# EAGLE design grissom (EAGLE 9.3.0)
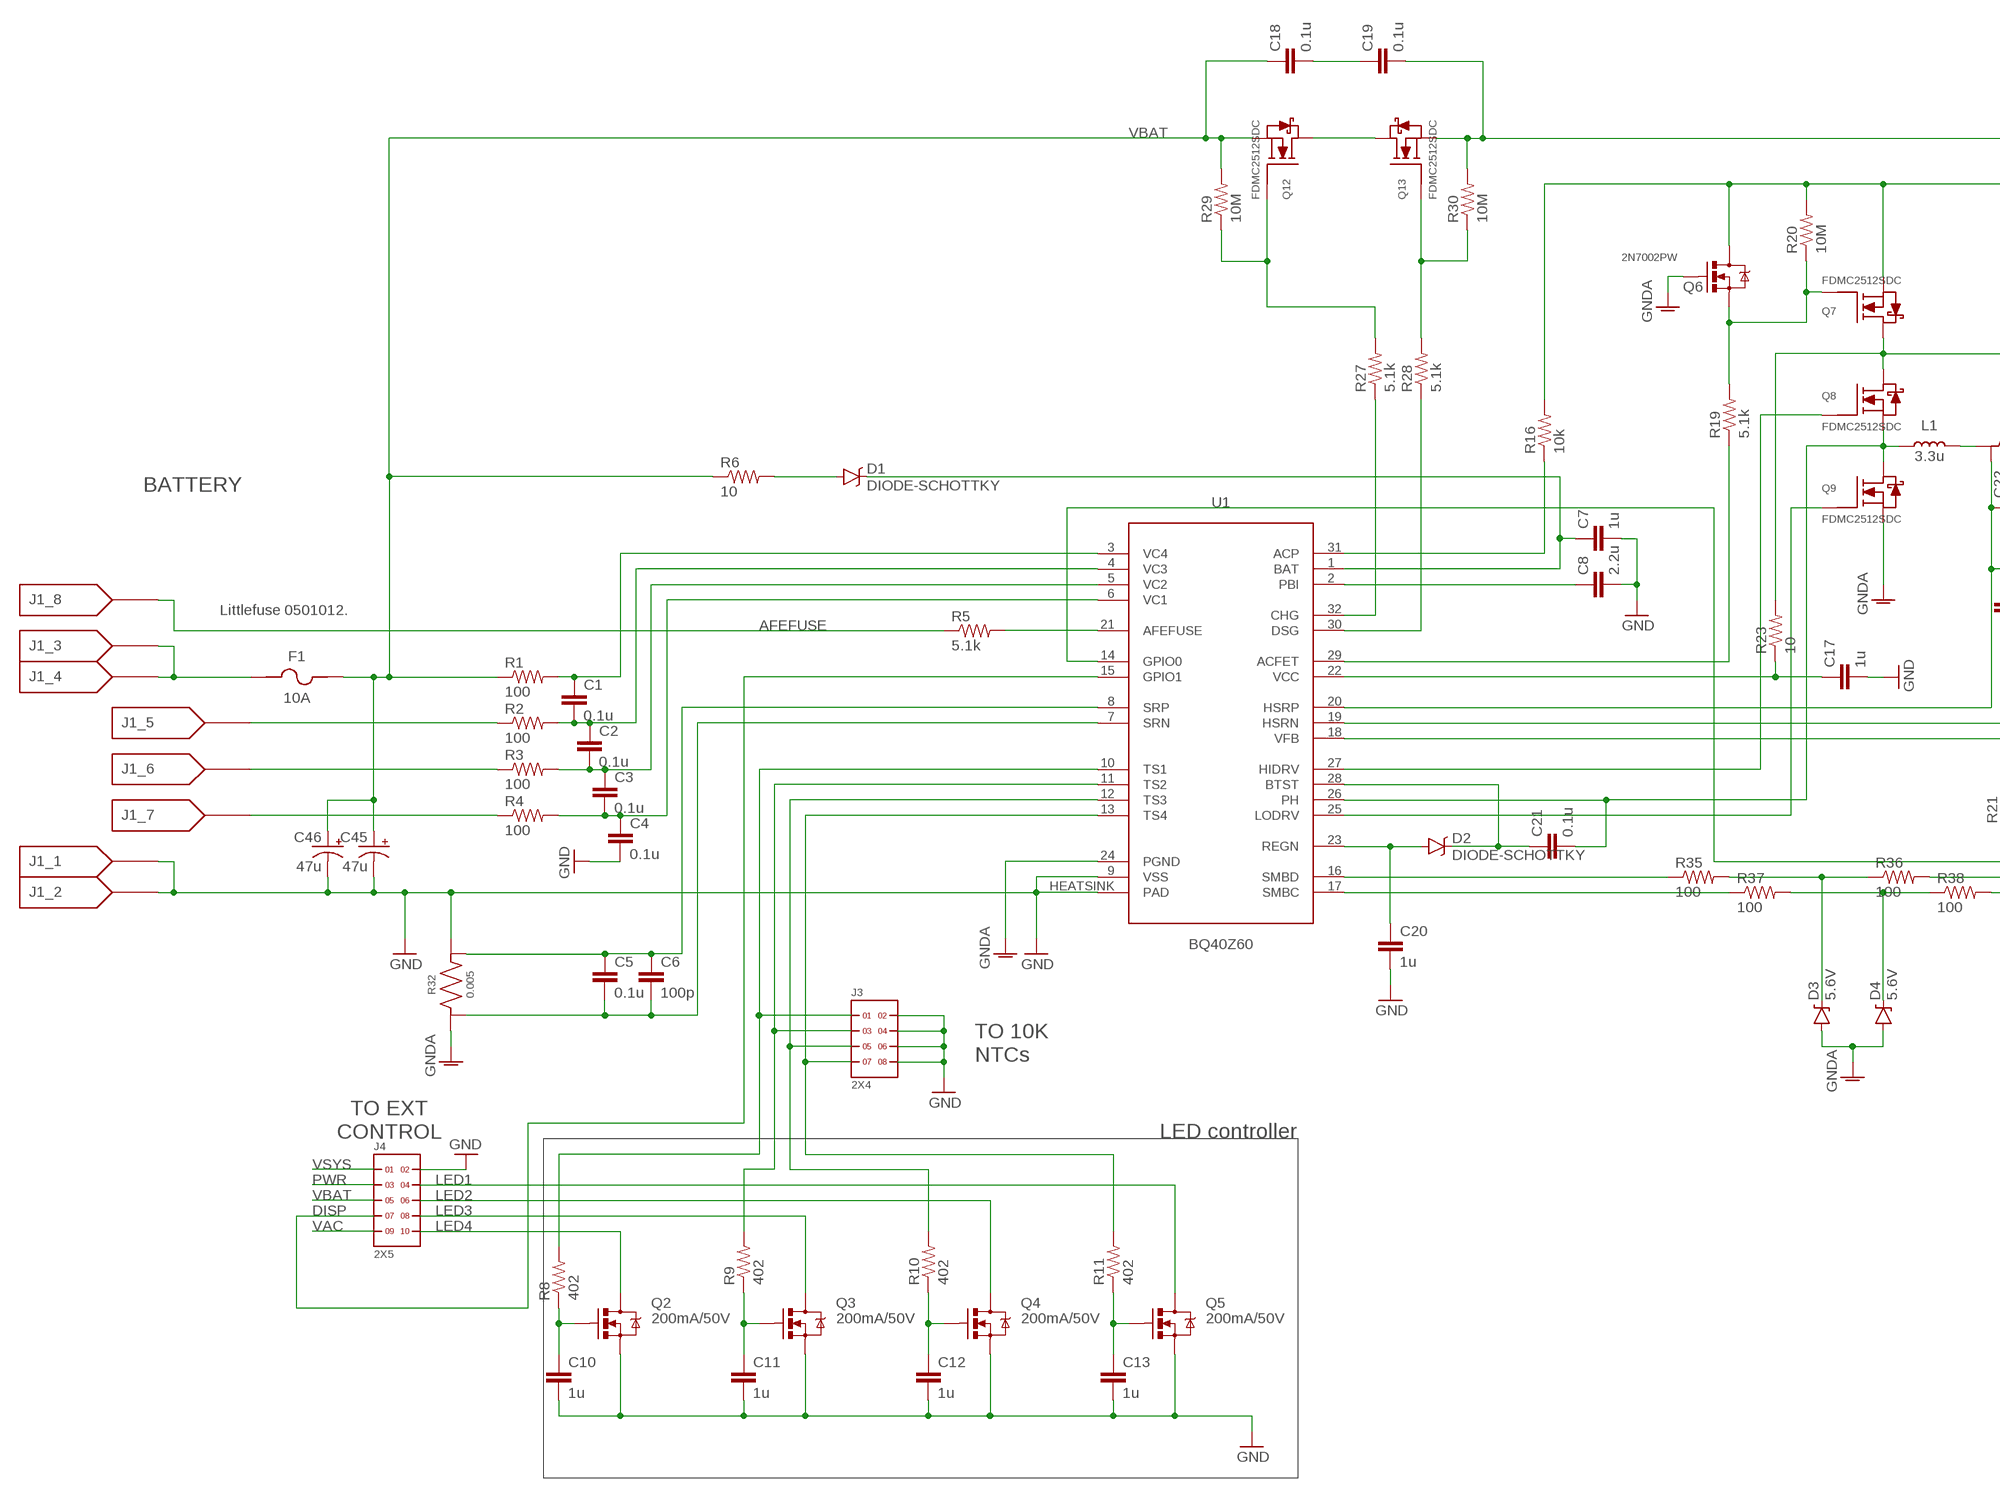
[diagram p0: schematic, sheet 1, part 1 of 2]
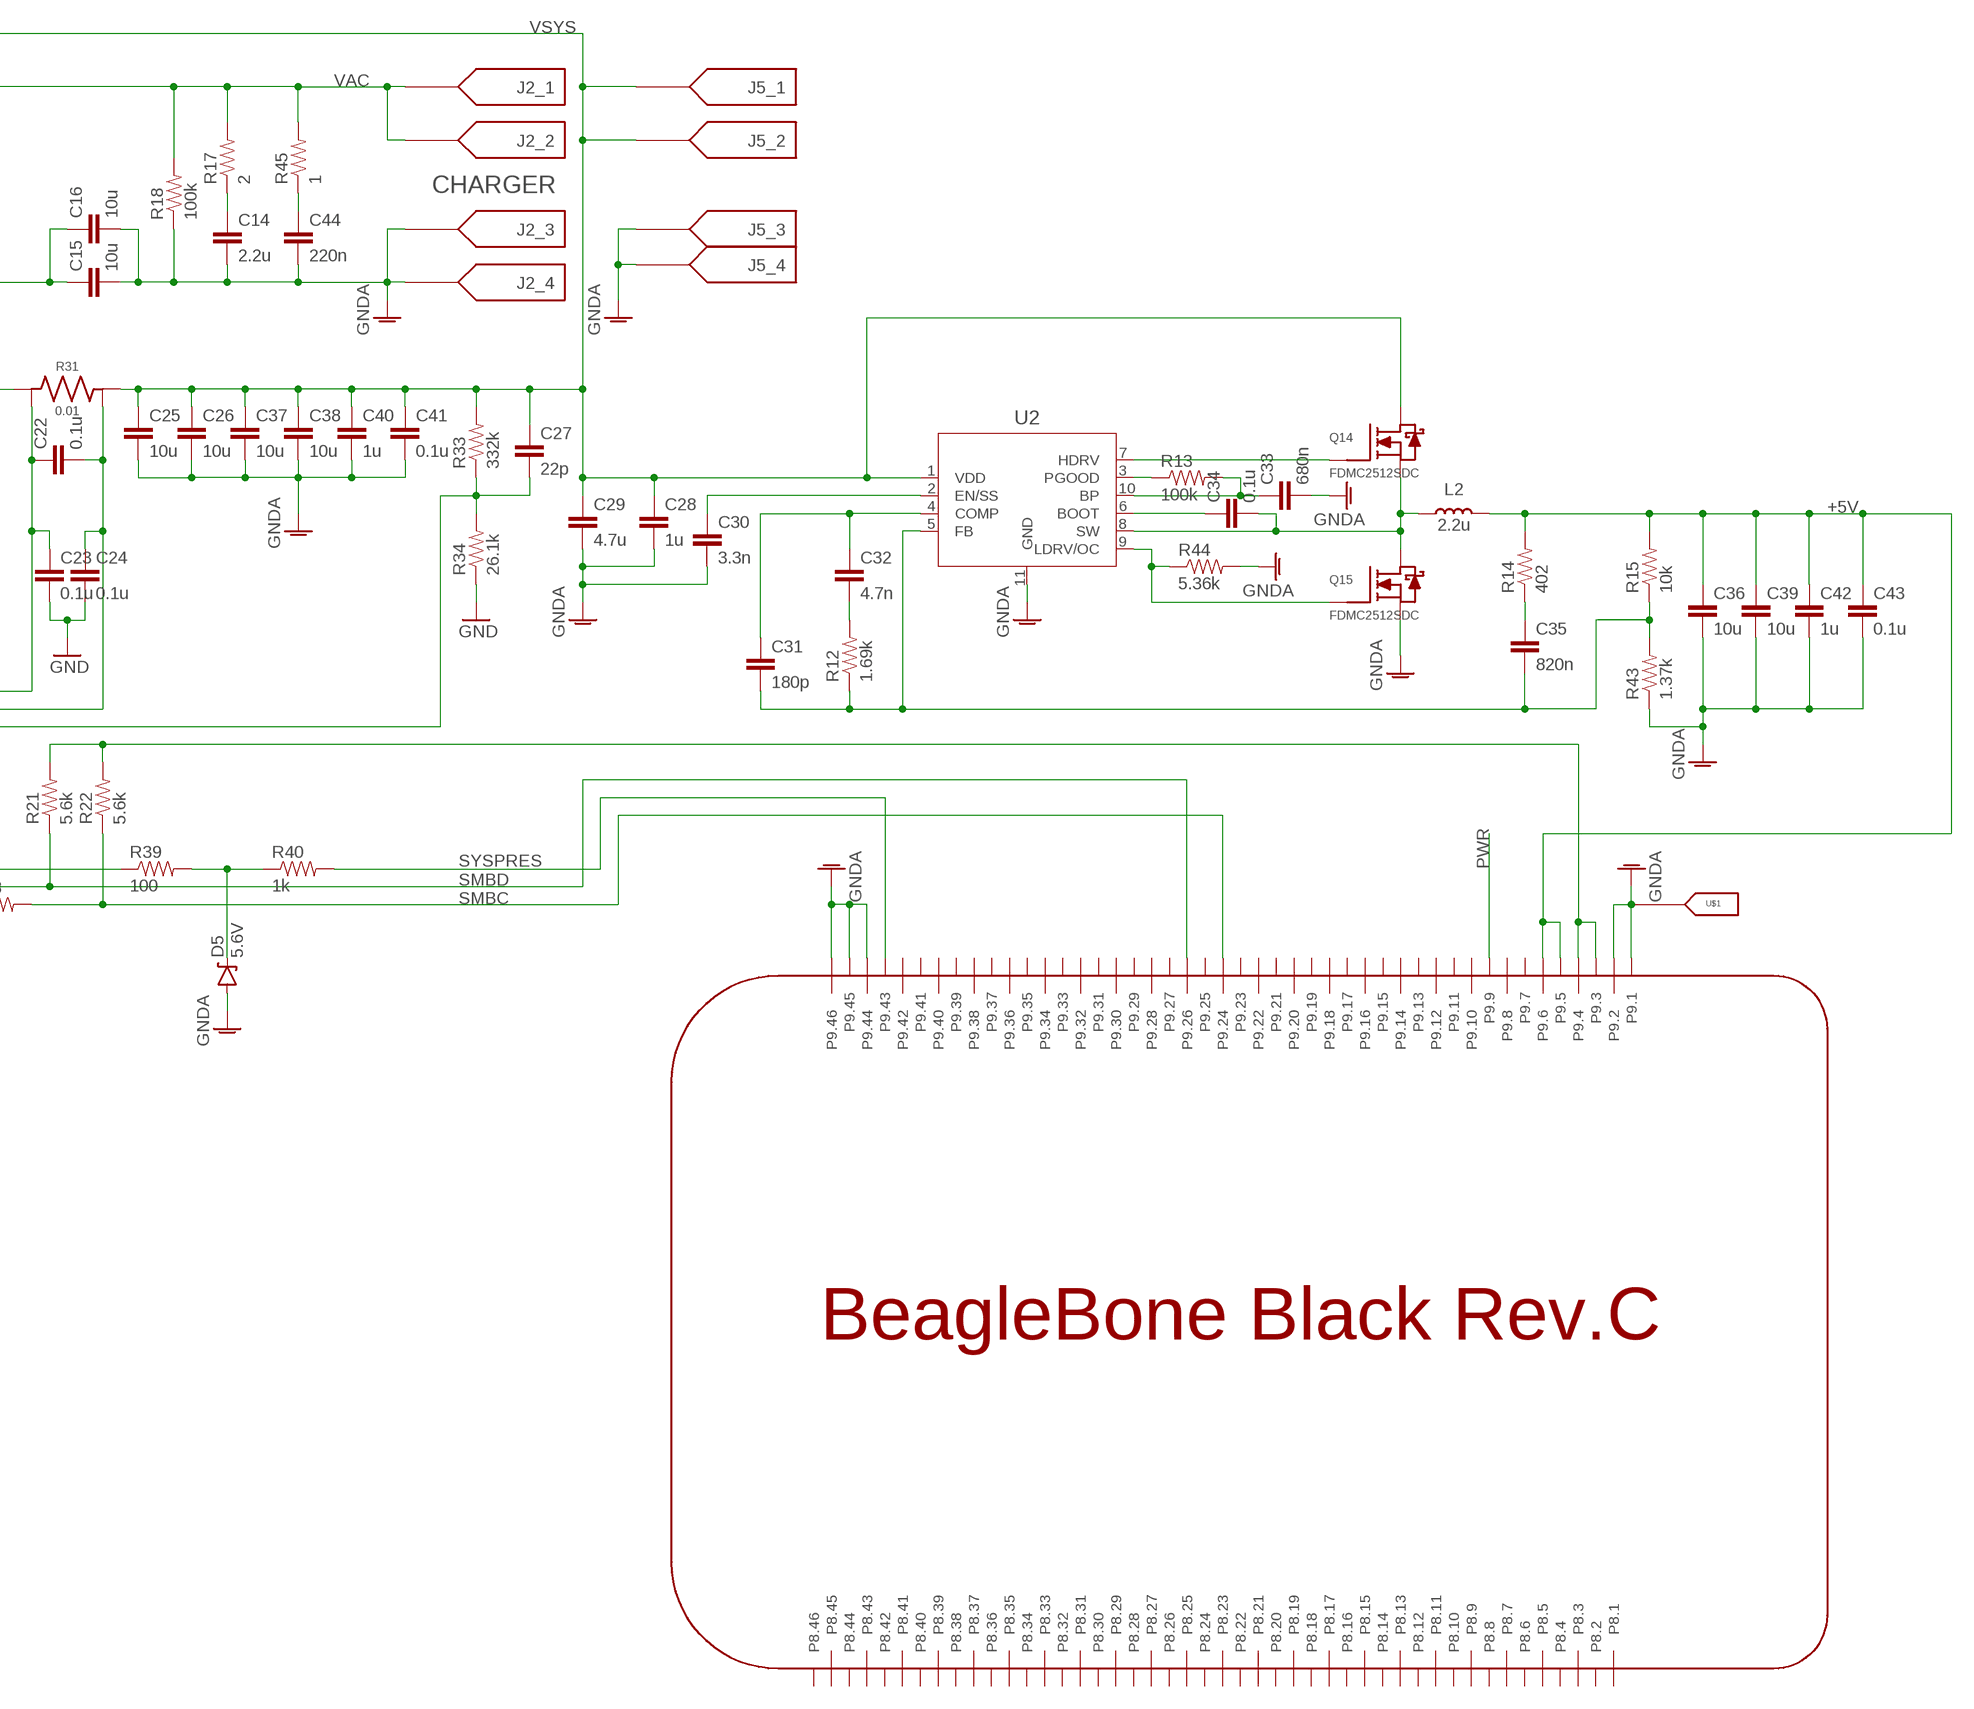
[diagram p1: schematic, sheet 1, part 2 of 2]

## Parts
C1  0.1u  CAP0805  [0805]
C2  0.1u  CAP0805  [0805]
C3  0.1u  CAP0805  [0805]
C4  0.1u  CAP0805  [0805]
C5  0.1u  CAP0805  [0805]
C6  100p  CAP0805  [0805]
C7  1u  CAP0805  [0805]
C8  2.2u  CAP0805  [0805]
C10  1u  CAP0805  [0805]
C11  1u  CAP0805  [0805]
C12  1u  CAP0805  [0805]
C13  1u  CAP0805  [0805]
C14  2.2u  CAP0805  [0805]
C15  10u  CAP1206  [1206]
C16  10u  CAP1206  [1206]
C17  1u  CAP0805  [0805]
C18  0.1u  CAP0805  [0805]
C19  0.1u  CAP0805  [0805]
C20  1u  CAP0805  [0805]
C21  0.1u  CAP0805  [0805]
C22  0.1u  CAP0805  [0805]
C23  0.1u  CAP0805  [0805]
C24  0.1u  CAP0805  [0805]
C25  10u  CAP1206  [1206]
C26  10u  CAP1206  [1206]
C27  22p  CAP0805  [0805]
C28  1u  CAP0805  [0805]
C29  4.7u  CAP0805  [0805]
C30  3.3n  CAP0805  [0805]
C31  180p  CAP0805  [0805]
C32  4.7n  CAP0805  [0805]
C33  680n  CAP0805  [0805]
C34  0.1u  CAP0805  [0805]
C35  820n  CAP0805  [0805]
C36  10u  CAP1206  [1206]
C37  10u  CAP1206  [1206]
C38  10u  CAP1206  [1206]
C39  10u  CAP1206  [1206]
C40  1u  CAP1206  [1206]
C41  0.1u  CAP1206  [1206]
C42  1u  CAP1206  [1206]
C43  0.1u  CAP1206  [1206]
C44  220n  CAP0805  [0805]
C45  47u  CAP_POLPTH2  [CPOL-RADIAL-10UF-25V]
C46  47u  CAP_POLPTH2  [CPOL-RADIAL-10UF-25V]
D1  DIODE-SCHOTTKY  [SOT23-3]
D2  DIODE-SCHOTTKY  [SOT23-3]
D3  5.6V  DIODE-ZENER5.6V  [SOD-323]
D4  5.6V  DIODE-ZENER5.6V  [SOD-323]
D5  5.6V  DIODE-ZENER5.6V  [SOD-323]
F1  10A  LITTELFUSE_501  [LITTELFUSE_501]
J1  105314-X208  [105314-X208]
J2  105314-X204  [105314-X204]
J3  2X4  [2X4]
J4  2X5  [2X5]
J5  105314-X204  [105314-X204]
L1  3.3u  BOURNS_SRP7028A  [BOURNS_SRP7028A]
L2  2.2u  BOURNS_SRP7028A  [BOURNS_SRP7028A]
PCB1  BEAGLEBONE_BLACK_BLANK  [BEAGLEBONE_BLACK_BLANK]
Q2  200mA/50V  MOSFET-NCHANNELBSS138  [SOT23-3]
Q3  200mA/50V  MOSFET-NCHANNELBSS138  [SOT23-3]
Q4  200mA/50V  MOSFET-NCHANNELBSS138  [SOT23-3]
Q5  200mA/50V  MOSFET-NCHANNELBSS138  [SOT23-3]
Q6  2N7002PW  MOSFET-NCHANNEL2N7002PW  [SOT323]
Q7  FDMC2512SDC  [MO240]
Q8  FDMC2512SDC  [MO240]
Q9  FDMC2512SDC  [MO240]
Q12  FDMC2512SDC  [MO240]
Q13  FDMC2512SDC  [MO240]
Q14  FDMC2512SDC  [MO240]
Q15  FDMC2512SDC  [MO240]
R1  100  RESISTOR0805-RES  [0805]
R2  100  RESISTOR0805-RES  [0805]
R3  100  RESISTOR0805-RES  [0805]
R4  100  RESISTOR0805-RES  [0805]
R5  5.1k  RESISTOR0805-RES  [0805]
R6  10  RESISTOR1206  [1206]
R8  402  RESISTOR0805-RES  [0805]
R9  402  RESISTOR0805-RES  [0805]
R10  402  RESISTOR0805-RES  [0805]
R11  402  RESISTOR0805-RES  [0805]
R12  1.69k  RESISTOR0805-RES  [0805]
R13  100k  RESISTOR0805-RES  [0805]
R14  402  RESISTOR0805-RES  [0805]
R15  10k  RESISTOR0805-RES  [0805]
R16  10k  RESISTOR0805-RES  [0805]
R17  2  RESISTOR0805-RES  [0805]
R18  100k  RESISTOR0805-RES  [0805]
R19  5.1k  RESISTOR0805-RES  [0805]
R20  10M  RESISTOR0805-RES  [0805]
R21  5.6k  RESISTOR0805-RES  [0805]
R22  5.6k  RESISTOR0805-RES  [0805]
R23  10  RESISTOR0805-RES  [0805]
R27  5.1k  RESISTOR0805-RES  [0805]
R28  5.1k  RESISTOR0805-RES  [0805]
R29  10M  RESISTOR0805-RES  [0805]
R30  10M  RESISTOR0805-RES  [0805]
R31  0.01  OHMITE_FC4L32  [1206_4T]
R32  0.005  VISHAY_WSK0612  [0612_4T]
R33  332k  RESISTOR0805-RES  [0805]
R34  26.1k  RESISTOR0805-RES  [0805]
R35  100  RESISTOR0805-RES  [0805]
R36  100  RESISTOR0805-RES  [0805]
R37  100  RESISTOR0805-RES  [0805]
R38  100  RESISTOR0805-RES  [0805]
R39  100  RESISTOR0805-RES  [0805]
R40  1k  RESISTOR0805-RES  [0805]
R43  1.37k  RESISTOR0805-RES  [0805]
R44  5.36k  RESISTOR0805-RES  [0805]
R45  1  RESISTOR0805-RES  [0805]
U1  BQ40Z60  [QFN32]
U2  TPS40305DRCR  [S-PVSON-N10]
U$1  SU_LOGO-DUMMY2  [SU_LOGO_SS]

## Nets
+5V: C36.1 C39.1 C42.1 C43.1 L2.P$2 PCB1.P9.5 PCB1.P9.6 R14.2 R15.2
AFEFUSE: J1.P$8 R5.1
DISP: J4.7 U1.15(GPIO1)
GND: C4.2 C7.2 C8.2 C10.2 C11.2 C12.2 C13.2 C17.2 C20.2 C23.2 C24.2 C45.2(-) C46.2(-) J1.P$1 J1.P$2 J3.2 J3.4 J3.6 J3.8 J4.2 Q2.2(S) Q3.2(S) Q4.2(S) Q5.2(S) R32.P$2 R34.1 U1.9(VSS) U1.HEATSINK(PAD)
GNDA: C14.2 C15.2 C16.2 C25.2 C26.2 C28.2 C29.2 C30.2 C33.2 C36.2 C37.2 C38.2 C39.2 C40.2 C41.2 C42.2 C43.2 C44.2 D3.A D4.A D5.A J2.P$3 J2.P$4 J5.P$3 J5.P$4 PCB1.P9.1 PCB1.P9.2 PCB1.P9.44 PCB1.P9.45 PCB1.P9.46 Q6.1(G) Q9.P$1(S) Q9.P$2(S) Q9.P$3(S) Q15.P$1(S) Q15.P$2(S) Q15.P$3(S) R18.1 R32.P$1 R43.1 R44.2 U1.24(PGND) U2.11(GND) U$1.P$1
LED1: J4.4 Q5.3(D)
LED2: J4.6 Q4.3(D)
LED3: J4.8 Q3.3(D)
LED4: J4.10 Q2.3(D)
N$1: R5.2 U1.21(AFEFUSE)
N$2: J1.P$5 R2.1
N$3: J1.P$6 R3.1
N$4: J1.P$7 R4.1
N$5: F1.P$1 J1.P$3 J1.P$4
N$6: C3.2 C4.1 R4.2 U1.6(VC1)
N$7: C1.1 R1.2 U1.3(VC4)
N$8: C1.2 C2.1 R2.2 U1.4(VC3)
N$9: C2.2 C3.1 R3.2 U1.5(VC2)
N$10: C5.1 C6.1 R32.P$4 U1.8(SRP)
N$11: C5.2 C6.2 R32.P$3 U1.7(SRN)
N$13: D1.1(A) D1.2(A) R6.2
N$14: C7.1 D1.3(C) U1.1(BAT)
N$15: C8.1 U1.2(PBI)
N$16: PCB1.P9.3 PCB1.P9.4 R21.2 R22.2
N$18: C17.1 R23.1 U1.22(VCC)
N$20: J3.1 R8.2 U1.10(TS1)
N$21: J3.3 R9.2 U1.11(TS2)
N$22: J3.5 R10.2 U1.12(TS3)
N$23: J3.7 R11.2 U1.13(TS4)
N$24: C10.1 Q2.1(G) R8.1
N$26: C11.1 Q3.1(G) R9.1
N$28: C12.1 Q4.1(G) R10.1
N$30: C13.1 Q5.1(G) R11.1
N$32: C32.2 R12.2
N$33: C30.1 U2.2(EN/SS)
N$34: C31.1 C32.1 U2.4(COMP)
N$35: C31.2 C35.2 R12.1 R15.1 R43.2 U2.5(FB)
N$36: C14.1 R17.1
N$37: R16.1 U1.31(ACP)
N$38: C34.2 L2.P$1 Q14.P$1(S) Q14.P$2(S) Q14.P$3(S) Q15.P$5(D) Q15.P$6(D) Q15.P$7(D) Q15.P$8(D) Q15.PAD(D) U2.8(SW)
N$39: C15.1 C16.1 Q7.P$5(D) Q7.P$6(D) Q7.P$7(D) Q7.P$8(D) Q7.PAD(D) Q8.P$5(D) Q8.P$6(D) Q8.P$7(D) Q8.P$8(D) Q8.PAD(D) R23.2
N$40: Q6.2(S) Q7.P$4(G) R19.2 R20.1
N$41: R19.1 U1.29(ACFET)
N$42: Q14.P$4(G) U2.7(HDRV)
N$43: Q8.P$4(G) U1.27(HIDRV)
N$45: Q9.P$4(G) U1.25(LODRV)
N$47: Q15.P$4(G) R44.1 U2.9(LDRV/OC)
N$48: R28.1 U1.30(DSG)
N$49: R27.1 U1.32(CHG)
N$50: Q13.P$4(G) R28.2 R30.1
N$51: Q12.P$4(G) R27.2 R29.1
N$52: Q12.P$5(D) Q12.P$6(D) Q12.P$7(D) Q12.P$8(D) Q12.PAD(D) Q13.P$5(D) Q13.P$6(D) Q13.P$7(D) Q13.P$8(D) Q13.PAD(D)
N$53: R13.1 U2.3(PGOOD)
N$54: C21.1 D2.3(C) U1.28(BTST)
N$55: C18.2 C19.1
N$56: C21.2 L1.P$1 Q8.P$1(S) Q8.P$2(S) Q8.P$3(S) Q9.P$5(D) Q9.P$6(D) Q9.P$7(D) Q9.P$8(D) Q9.PAD(D) U1.26(PH)
N$57: C20.1 D2.1(A) D2.2(A) U1.23(REGN)
N$58: L1.P$2 R31.P$1
N$59: C22.1 C23.1 R31.P$3 U1.20(HSRP)
N$60: C22.2 C24.1 R31.P$4 U1.19(HSRN)
N$62: C27.2 R33.1 R34.2 U1.18(VFB)
N$64: R35.1 U1.16(SMBD)
N$65: D3.C R35.2 R36.1
N$66: PCB1.P9.26 R21.1 R36.2
N$67: R37.1 U1.17(SMBC)
N$68: D4.C R37.2 R38.1
N$69: PCB1.P9.24 R22.1 R38.2
N$70: C33.1 R13.2 U2.10(BP)
N$71: R39.1 U1.14(GPIO0)
N$72: D5.C R39.2 R40.1
N$73: PCB1.P9.43 R40.2
N$74: C34.1 U2.6(BOOT)
N$76: C35.1 R14.1
N$77: C44.1 R45.1
PWR: J4.3 PCB1.P9.9
VAC: J2.P$1 J2.P$2 J4.9 Q6.3(D) Q7.P$1(S) Q7.P$2(S) Q7.P$3(S) R16.2 R17.2 R18.2 R20.2 R45.2
VBAT: C18.1 C45.1(+) C46.1(+) F1.P$2 J4.5 Q12.P$1(S) Q12.P$2(S) Q12.P$3(S) R1.1 R6.1 R29.2
VSYS: C19.2 C25.1 C26.1 C27.1 C28.1 C29.1 C37.1 C38.1 C40.1 C41.1 J4.1 J5.P$1 J5.P$2 Q13.P$1(S) Q13.P$2(S) Q13.P$3(S) Q14.P$5(D) Q14.P$6(D) Q14.P$7(D) Q14.P$8(D) Q14.PAD(D) R30.2 R31.P$2 R33.2 U2.1(VDD)
Unconnected: PCB1.P8.1 PCB1.P8.2 PCB1.P8.3 PCB1.P8.4 PCB1.P8.5 PCB1.P8.6 PCB1.P8.7 PCB1.P8.8 PCB1.P8.9 PCB1.P8.10 PCB1.P8.11 PCB1.P8.12 PCB1.P8.13 PCB1.P8.14 PCB1.P8.15 PCB1.P8.16 PCB1.P8.17 PCB1.P8.18 PCB1.P8.19 PCB1.P8.20 PCB1.P8.21 PCB1.P8.22 PCB1.P8.23 PCB1.P8.24 PCB1.P8.25 PCB1.P8.26 PCB1.P8.27 PCB1.P8.28 PCB1.P8.29 PCB1.P8.30 PCB1.P8.31 PCB1.P8.32 PCB1.P8.33 PCB1.P8.34 PCB1.P8.35 PCB1.P8.36 PCB1.P8.37 PCB1.P8.38 PCB1.P8.39 PCB1.P8.40 PCB1.P8.41 PCB1.P8.42 PCB1.P8.43 PCB1.P8.44 PCB1.P8.45 PCB1.P8.46 PCB1.P9.7 PCB1.P9.8 PCB1.P9.10 PCB1.P9.11 PCB1.P9.12 PCB1.P9.13 PCB1.P9.14 PCB1.P9.15 PCB1.P9.16 PCB1.P9.17 PCB1.P9.18 PCB1.P9.19 PCB1.P9.20 PCB1.P9.21 PCB1.P9.22 PCB1.P9.23 PCB1.P9.25 PCB1.P9.27 PCB1.P9.28 PCB1.P9.29 PCB1.P9.30 PCB1.P9.31 PCB1.P9.32 PCB1.P9.33 PCB1.P9.34 PCB1.P9.35 PCB1.P9.36 PCB1.P9.37 PCB1.P9.38 PCB1.P9.39 PCB1.P9.40 PCB1.P9.41 PCB1.P9.42

## Notes on the sheet
- CHARGER
- BATTERY
- Littlefuse 0501012.
- SYSPRES
  SMBD
  SMBC
- TO 10K
  NTCs
- TO EXT
  CONTROL
- LED controller

## Library data of the parts
C1-C8 C10-C44 = SparkFun-Capacitors:CAP: Capacitor Standard 0603 ceramic capacitor, and 0.1" leaded capacitor.
C45 C46 = SparkFun-Capacitors:CAP_POL: Capacitor Polarized These are standard SMD and PTH capacitors. Normally 10uF, 47uF, and 100uF in electrolytic and tantalum varieties. Always verify the external diameter of the through hole cap, it varies with capacity, voltage, and manufacturer. The EIA devices should be standard.
D1 D2 = SparkFun-DiscreteSemi:DIODE-SCHOTTKY: Schottky diodes in SFE's production catalog BAT20J 1A 23V 0.62Vf RB751 120mA 40V 0.37Vf PMEG4005EJ 0.5A 40V 0.42Vf MBRA140 1A 40V 0.5Vf B340A 3A 40V SMA
D3-D5 = SparkFun-DiscreteSemi:DIODE-ZENER: Zener Diode Production Part - 8199 3.4V Zener Voltage; PROD_ID: DIO-12442
F1 = components:LITTELFUSE_501
J1 = molex_nanofit:105314-X208
J2 J5 = molex_nanofit:105314-X204
J3 = headers(2mm):2X4
J4 = headers(2mm):2X5
L1 L2 = components:BOURNS_SRP7028A
PCB1 = e14_BeagleBoneBlack_RevB:BEAGLEBONE_BLACK_BLANK
Q2-Q5 = SparkFun-DiscreteSemi:MOSFET-NCHANNEL: Common NMOSFET Parts MFG P/N Store ID Prod ID FDD8780 TRANS-09984 SI7820DN TRANS-11055 FDS6630A IC-08089 2N7002PW TRANS-11151 FQP30N06L COM-10213 TRANS-10060 BSS123LT1G TRANS-08345 BSS138 TRANS-00830 BS170 2N7000; PROD_ID: TRANS-00830
Q6 = SparkFun-DiscreteSemi:MOSFET-NCHANNEL: Common NMOSFET Parts MFG P/N Store ID Prod ID FDD8780 TRANS-09984 SI7820DN TRANS-11055 FDS6630A IC-08089 2N7002PW TRANS-11151 FQP30N06L COM-10213 TRANS-10060 BSS123LT1G TRANS-08345 BSS138 TRANS-00830 BS170 2N7000; PROD_ID: TRANS-11151
Q7-Q9 Q12-Q15 = components:FDMC2512SDC
R1-R6 R8-R23 R27-R30 R33-R40 R43-R45 = SparkFun-Resistors:RESISTOR: Resistor Basic schematic elements and footprints for 0603, 1206, and PTH resistors.
R31 = components:OHMITE_FC4L32
R32 = components:VISHAY_WSK0612
U1 = components:BQ40Z60
U2 = TPS40305:TPS40305DRCR; DATASHEETURL: http://www.ti.com/product/tps40305; FREQUENCY: 1200000.0; IMAX: 25.0; MANUFACTURER_NAME: Texas Instruments; MANUFACTURER_PART_NUMBER: TPS40305DRCR; MKTG_PACKAGE: TPS40305; NSID: TPS40305DRCT; PACKAGE: TPS40305; VENDOR: Texas Instruments
U$1 = components:SU_LOGO-DUMMY2

## Board
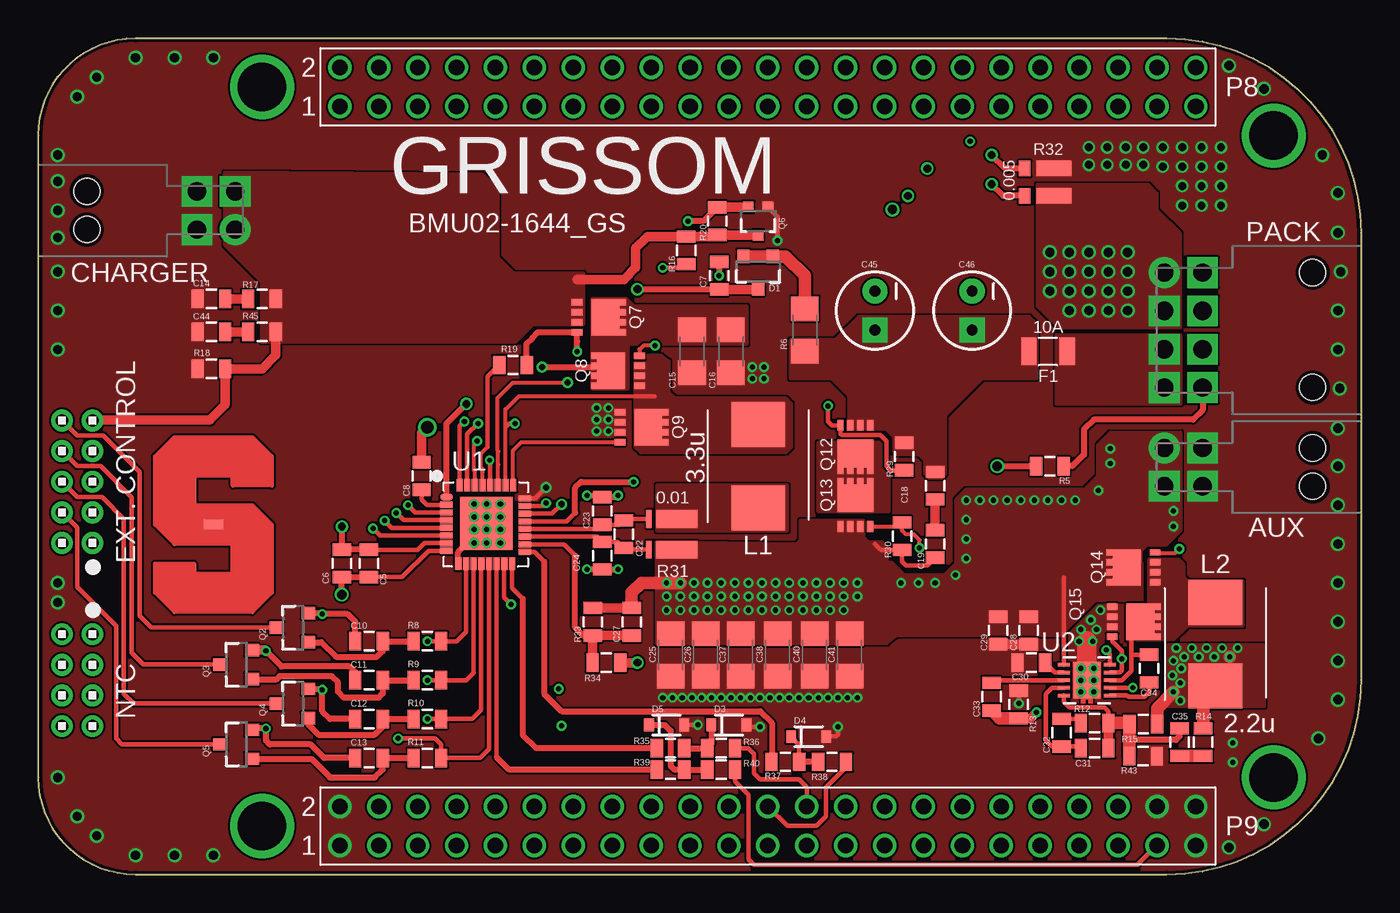
[diagram p2: board, top side]
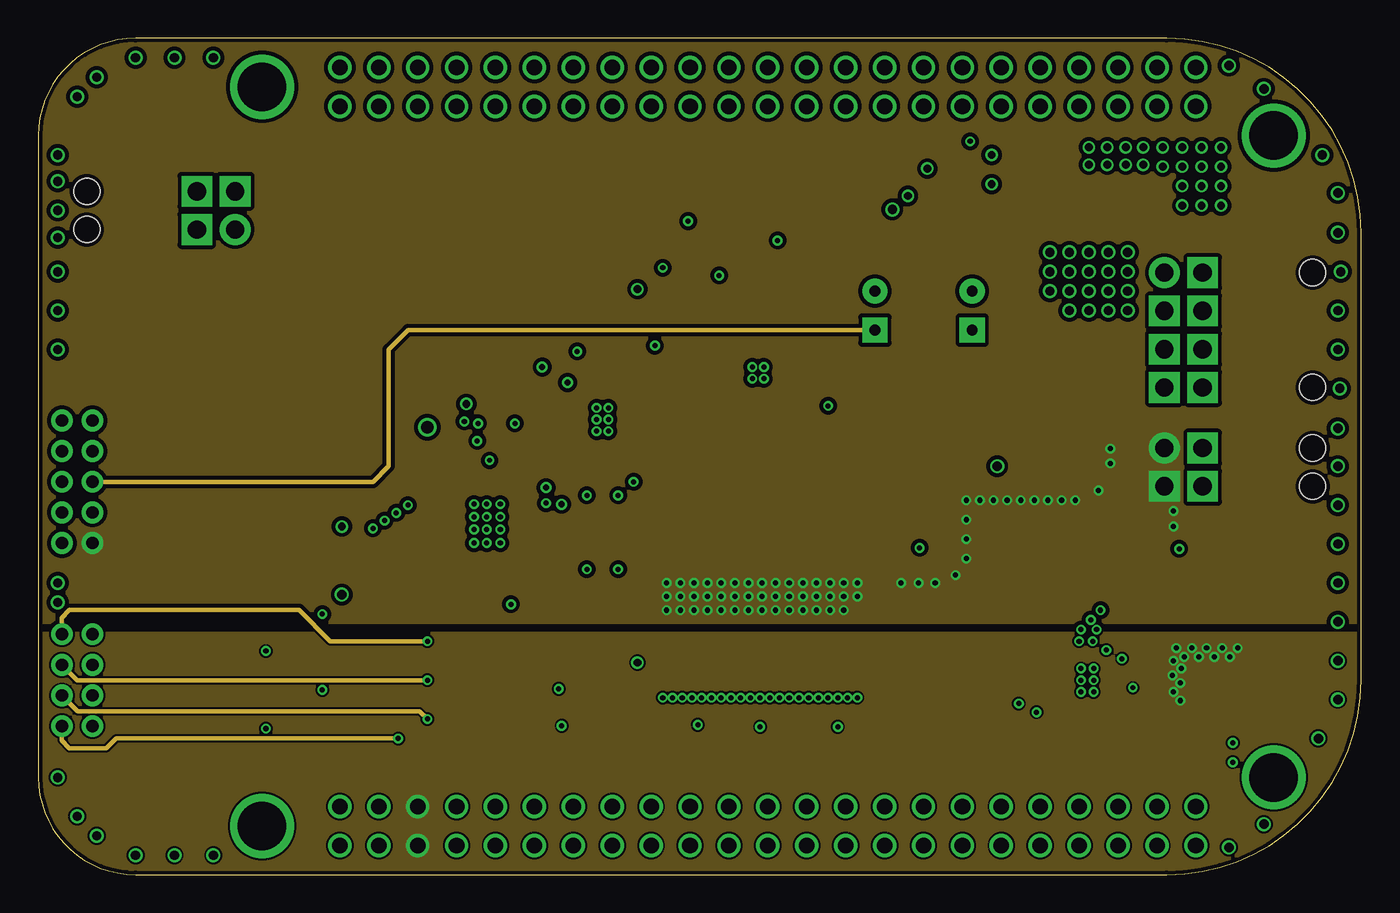
[diagram p3: board, inner layer Route2]
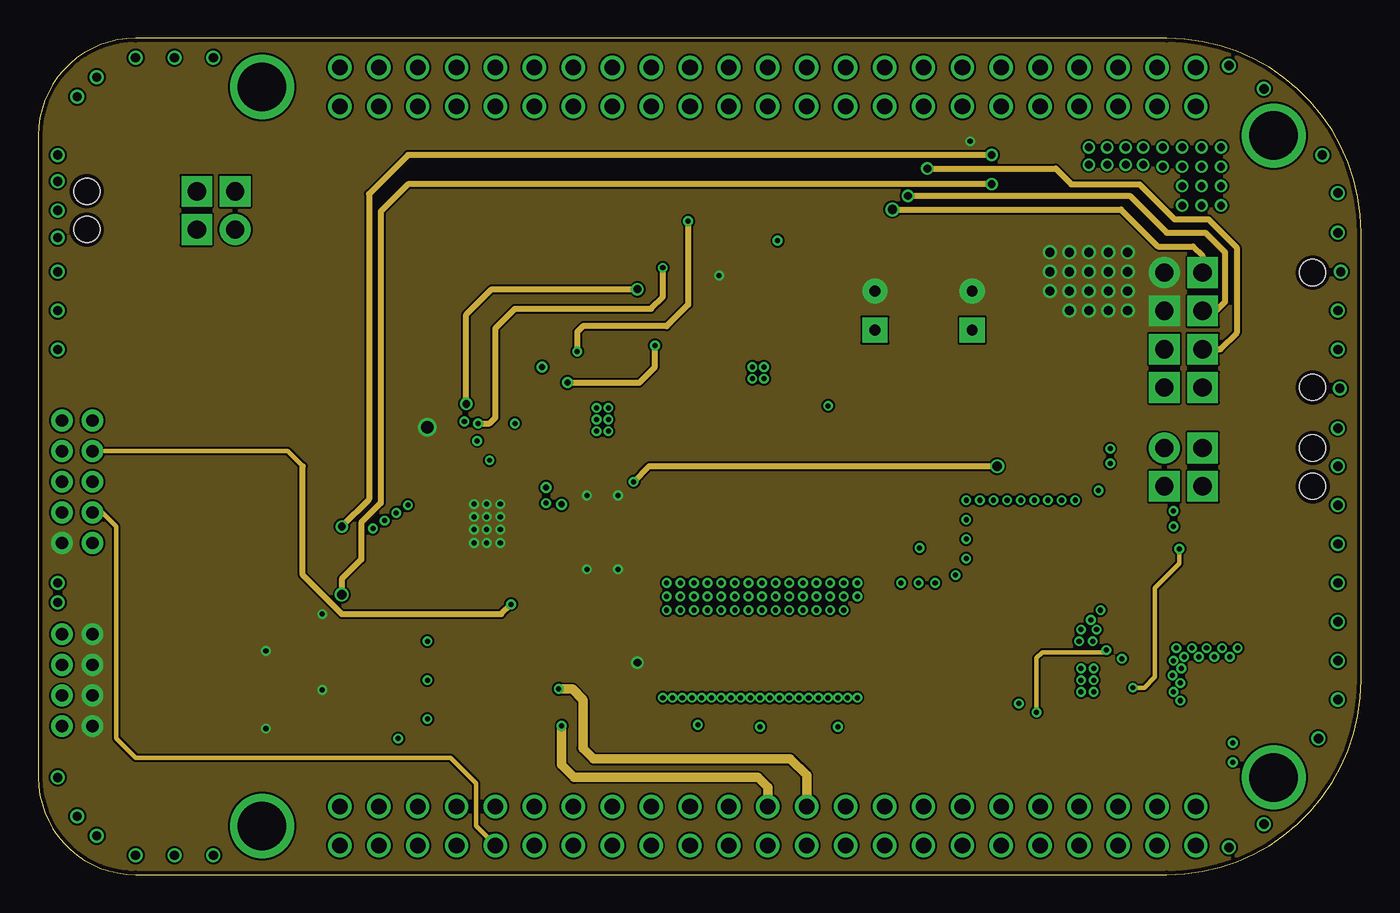
[diagram p4: board, inner layer Route15]
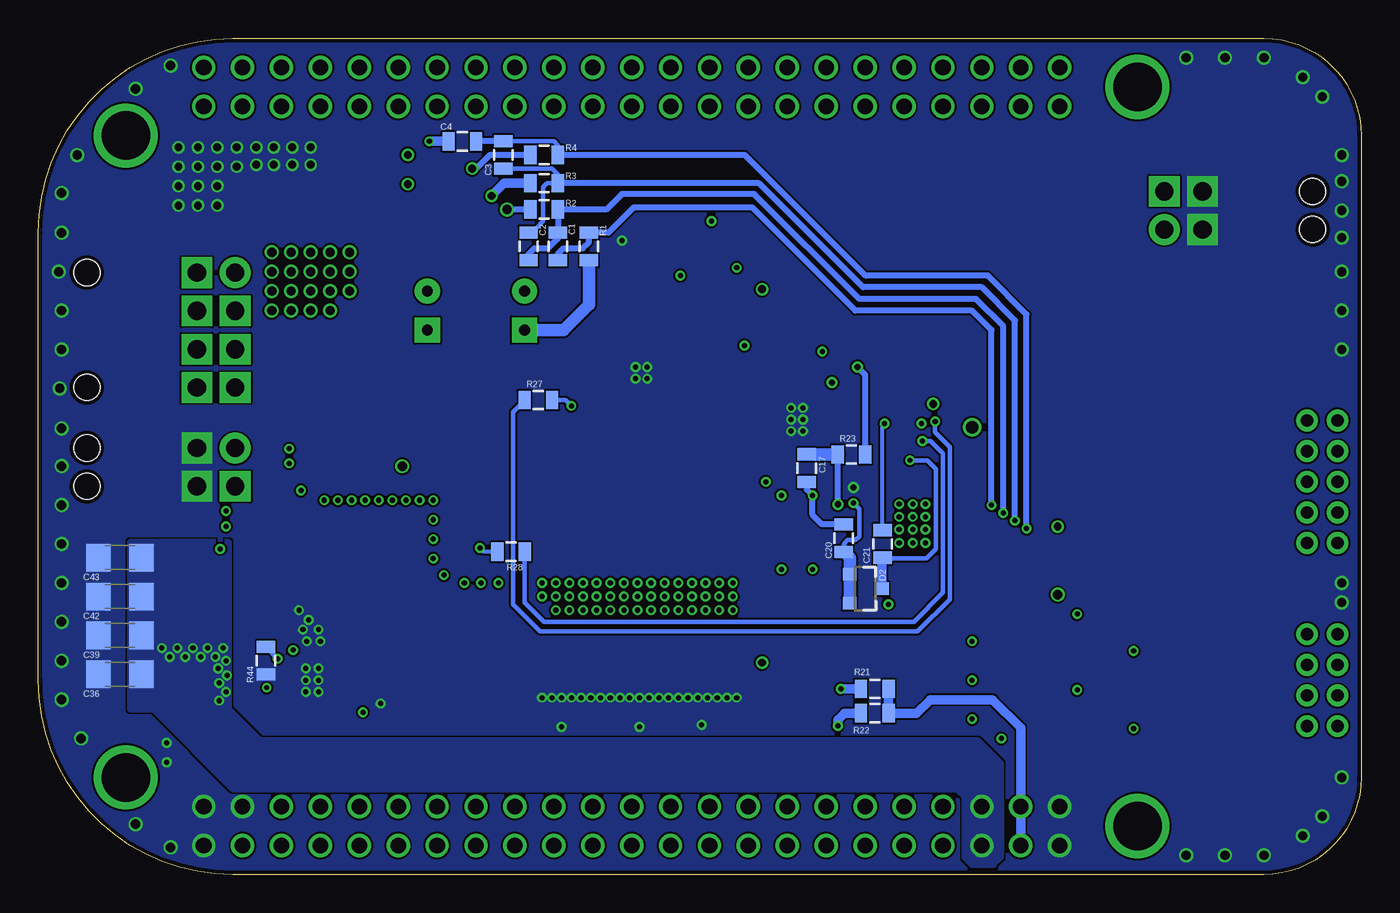
[diagram p5: board, bottom side, seen from below]

Size 86.36 x 54.61 mm. Coordinates in mm from the lower left corner, seen from the top.
Outline: 6.35,0 73.66,0 arc90 86.36,12.7 86.36,41.91 arc90 73.66,54.61 6.35,54.61 arc90 0,48.26 0,6.35 arc90 6.35,0
Copper layers (1*2*15*16): Top 0.035559375mm / dielectric 0.2mm / Route2 0.01778125mm / dielectric 1.2mm / Route15 0.01778125mm / dielectric 0.2mm / Bottom 0.035559375mm
Design rules "DirtyPCBs-4layer": minimum track width 5mil, minimum drill 12mil, track to track 5mil, track to pad 5mil, pad to pad 5mil, via to via 5mil, smd to smd 0mil, copper to edge 10mil, drill to drill 10mil, minimum pad ring 10mil, minimum via ring 6mil, stop-mask expansion 2mil, vias tented up to drill 25mil, thermal gap 10mil

### Footprints (pad centres in the part's own frame; a part is rotated, then mirrored left to right if it is on the bottom)
0805 = smd 0.8 x 1.2: 1 -0.9,0; 2 0.9,0
1206 = smd 1.6 x 1.8: 1 -1.4,0; 2 1.4,0
CPOL-RADIAL-10UF-25V = drill 0.7 pad 1.651 square: 1 1.27,0 | drill 0.7 pad 1.651: 2 -1.27,0
SOT23-3 = smd 0.8 x 0.9: 1 -0.95,-1; 2 0.95,-1; 3 0,1.1
SOD-323 = smd 0.63 x 0.83: A 1.15,0; C -1.15,0
LITTELFUSE_501 = smd 1 x 1.8: P$1 -1.25,0; P$2 1.25,0
105314-X208 = drill 1.2 pad 2: P$1 3.75,2.5 | drill 1.2 pad 2 square: P$2 1.25,2.5; P$3 -1.25,2.5; P$4 -3.75,2.5; P$5 3.75,0; P$6 1.25,0; P$7 -1.25,0; P$8 -3.75,0 | hole 1.7: -3.75,-7.18; 3.75,-7.18
105314-X204 = drill 1.2 pad 2: P$1 1.25,2.5 | drill 1.2 pad 2 square: P$2 -1.25,2.5; P$3 1.25,0; P$4 -1.25,0 | hole 1.7: -1.25,-7.18; 1.25,-7.18
2X4 = drill 0.8 pad 1.422: 1 -3,-1; 2 -3,1; 3 -1,-1; 4 -1,1; 5 1,-1; 6 1,1; 7 3,-1; 8 3,1
2X5 = drill 0.8 pad 1.422: 1 -4,-1; 2 -4,1; 3 -2,-1; 4 -2,1; 5 0,-1; 6 0,1; 7 2,-1; 8 2,1; 9 4,-1; 10 4,1
BOURNS_SRP7028A = smd 2.95 x 3.5: P$1 -2.725,0; P$2 2.725,0
BEAGLEBONE_BLACK_BLANK = drill 3.175: H1 14.605,3.175; H2 80.645,6.35; H3 80.645,48.26; H4 14.605,51.435 | drill 1.016: P8.1 19.685,50.165; P8.2 19.685,52.705; P8.3 22.225,50.165; P8.4 22.225,52.705; P8.5 24.765,50.165; P8.6 24.765,52.705; P8.7 27.305,50.165; P8.8 27.305,52.705; P8.9 29.845,50.165; P8.10 29.845,52.705; P8.11 32.385,50.165; P8.12 32.385,52.705; P8.13 34.925,50.165; P8.14 34.925,52.705; P8.15 37.465,50.165; P8.16 37.465,52.705; P8.17 40.005,50.165; P8.18 40.005,52.705; P8.19 42.545,50.165; P8.20 42.545,52.705; P8.21 45.085,50.165; P8.22 45.085,52.705; P8.23 47.625,50.165; P8.24 47.625,52.705; P8.25 50.165,50.165; P8.26 50.165,52.705; P8.27 52.705,50.165; P8.28 52.705,52.705; P8.29 55.245,50.165; P8.30 55.245,52.705; P8.31 57.785,50.165; P8.32 57.785,52.705; P8.33 60.325,50.165; P8.34 60.325,52.705; P8.35 62.865,50.165; P8.36 62.865,52.705; P8.37 65.405,50.165; P8.38 65.405,52.705; P8.39 67.945,50.165; P8.40 67.945,52.705; P8.41 70.485,50.165; P8.42 70.485,52.705; P8.43 73.025,50.165; P8.44 73.025,52.705; P8.45 75.565,50.165; P8.46 75.565,52.705; P9.1 19.685,1.905; P9.2 19.685,4.445; P9.3 22.225,1.905; P9.4 22.225,4.445; P9.5 24.765,1.905; P9.6 24.765,4.445; P9.7 27.305,1.905; P9.8 27.305,4.445; P9.9 29.845,1.905; P9.10 29.845,4.445; P9.11 32.385,1.905; P9.12 32.385,4.445; P9.13 34.925,1.905; P9.14 34.925,4.445; P9.15 37.465,1.905; P9.16 37.465,4.445; P9.17 40.005,1.905; P9.18 40.005,4.445; P9.19 42.545,1.905; P9.20 42.545,4.445; P9.21 45.085,1.905; P9.22 45.085,4.445; P9.23 47.625,1.905; P9.24 47.625,4.445; P9.25 50.165,1.905; P9.26 50.165,4.445; P9.27 52.705,1.905; P9.28 52.705,4.445; P9.29 55.245,1.905; P9.30 55.245,4.445; P9.31 57.785,1.905; P9.32 57.785,4.445; P9.33 60.325,1.905; P9.34 60.325,4.445; P9.35 62.865,1.905; P9.36 62.865,4.445; P9.37 65.405,1.905; P9.38 65.405,4.445; P9.39 67.945,1.905; P9.40 67.945,4.445; P9.41 70.485,1.905; P9.42 70.485,4.445; P9.43 73.025,1.905; P9.44 73.025,4.445; P9.45 75.565,1.905; P9.46 75.565,4.445
SOT323 = smd 0.7 x 0.7: 1 -0.65,-0.925; 2 0.65,-0.925; 3 0,0.925
MO240 = smd 0.42 x 0.7: P$1 -0.975,-1.4; P$2 -0.325,-1.4; P$3 0.325,-1.4; P$4 0.975,-1.4; P$5 0.975,1.425; P$6 0.325,1.425; P$7 -0.325,1.425; P$8 -0.975,1.425 | smd 2.37 x 1.82: PAD 0,0.45
1206_4T = smd 2.7 x 1.15: P$1 -0.275,-1; P$2 -0.275,1 | smd 0.35 x 1.15: P$3 1.55,-1; P$4 1.55,1
0612_4T = smd 2.286 x 1.016: P$1 0,-0.889; P$2 0,0.889 | smd 0.762 x 1.016: P$3 1.905,-0.889; P$4 1.905,0.889
QFN32 = smd 0.813 x 0.406: 1 -2.56,1.79; 2 -2.56,1.29; 3 -2.56,0.79; 4 -2.56,0.29; 5 -2.56,-0.21; 6 -2.56,-0.71; 7 -2.56,-1.21; 8 -2.56,-1.71; 17 2.56,-1.79; 18 2.56,-1.29; 19 2.56,-0.79; 20 2.56,-0.29; 21 2.56,0.21; 22 2.56,0.71; 23 2.56,1.21; 24 2.56,1.71 | smd 0.406 x 0.813: 9 -1.79,-2.56; 10 -1.29,-2.56; 11 -0.79,-2.56; 12 -0.29,-2.56; 13 0.21,-2.56; 14 0.71,-2.56; 15 1.21,-2.56; 16 1.71,-2.56; 25 1.79,2.56; 26 1.29,2.56; 27 0.79,2.56; 28 0.29,2.56; 29 -0.21,2.56; 30 -0.71,2.56; 31 -1.21,2.56; 32 -1.71,2.56 | smd 3.45 x 3.45: HEATSINK 0.04,0.06
S-PVSON-N10 = smd 0.8 x 0.23: 1 -1.5,1; 2 -1.5,0.5; 3 -1.5,0; 4 -1.5,-0.5; 5 -1.5,-1; 6 1.5,-1; 7 1.5,-0.5; 8 1.5,0; 9 1.5,0.5; 10 1.5,1 | smd 1.75 x 2.4: 11 0,0
SU_LOGO_SS = smd 1.27 x 0.635: P$1 0,0

### Placement (x,y rotation side)
C1  52.45,41.02 90 bottom
C2  54.36,41.02 90 bottom
C3  56.01,46.99 90 bottom
C4  58.67,47.88 180 bottom
C5  21.59,20.32 90 top
C6  19.81,20.32 90 top
C7  44.45,39.12 90 top
C8  25.02,26.04 90 top
C10  21.59,15.24 180 top
C11  21.59,12.7 180 top
C12  21.59,10.16 180 top
C13  21.59,7.62 180 top
C14  11.3,37.59 180 top
C15  42.67,34.16 270 top
C16  45.21,34.16 270 top
C17  36.2,26.54 270 bottom
C18  58.55,25.4 270 top
C19  58.55,21.59 270 top
C20  33.78,21.97 90 bottom
C21  31.24,21.59 90 bottom
C22  38.23,22.23 270 top
C23  36.83,23.75 90 top
C24  36.83,20.83 270 top
C25  41.27,14.35 270 top
C26  43.56,14.35 270 top
C27  38.73,16.51 270 top
C28  64.64,15.95 270 top
C29  62.66,15.95 270 top
C30  64.82,13.84 180 top
C31  68.96,8.26 0 top
C32  66.8,9.27 90 top
C33  64.01,11.11 90 top
C34  72.52,13.46 90 top
C35  74.5,8.66 90 top
C36  81.03,13.08 180 bottom
C37  45.85,14.35 270 top
C38  48.26,14.35 270 top
C39  81.03,15.62 180 bottom
C40  50.67,14.35 270 top
C41  52.96,14.35 270 top
C42  81.03,18.16 180 bottom
C43  81.03,20.7 180 bottom
C44  11.3,35.43 180 top
C45  54.61,36.83 270 top
C46  60.96,36.83 270 top
D1  46.99,39.37 180 top
D2  32.38,18.67 270 bottom
D3  45.09,9.78 0 top
D4  50.29,9.02 0 top
D5  41.02,9.78 0 top
F1  65.91,34.16 180 top
J1  76.01,35.56 90 top
J2  10.35,43.37 270 top
J3  2.54,12.7 270 top
J4  2.54,25.65 90 top
J5  76.01,26.61 90 top
L1  46.99,26.67 270 top
L2  76.83,15.05 270 top
PCB1  0,0 0 top
Q2  16.64,16.13 90 top
Q3  12.95,13.72 90 top
Q4  16.64,11.18 90 top
Q5  12.95,8.51 90 top
Q6  46.99,42.67 180 top
Q7  36.58,36.39 270 top
Q8  37.85,32.89 90 top
Q9  39.37,29.21 270 top
Q12  53.34,27.94 180 top
Q13  53.34,24.13 0 top
Q14  71.5,20.07 90 top
Q15  71.5,16.51 270 top
R1  50.42,41.02 90 bottom
R2  53.34,43.43 0 bottom
R3  53.34,45.15 0 bottom
R4  53.34,46.99 0 bottom
R5  66.04,26.67 180 top
R6  50.04,35.56 90 top
R8  25.4,15.24 0 top
R9  25.4,12.7 0 top
R10  25.4,10.16 0 top
R11  25.4,7.62 0 top
R12  68.96,9.91 180 top
R13  62.23,11.62 270 top
R14  76.05,8.66 90 top
R15  72.14,9.84 0 top
R16  42.29,40.77 90 top
R17  14.61,37.59 0 top
R18  11.3,33.02 0 top
R19  30.99,33.27 0 top
R20  44.32,42.67 270 top
R21  31.75,12.13 0 bottom
R22  31.75,10.54 0 bottom
R23  33.27,27.43 0 bottom
R27  53.72,30.99 0 bottom
R28  55.5,21.08 180 bottom
R29  56.52,27.3 90 top
R30  56.39,22.1 270 top
R31  41.4,22.23 180 top
R32  66.29,45.21 180 top
R33  36.2,16.51 90 top
R34  37.08,13.84 180 top
R35  41.27,8.26 0 top
R36  44.58,8.26 0 top
R37  48.77,7.37 0 top
R38  51.82,7.37 0 top
R39  41.27,6.86 0 top
R40  44.58,6.86 0 top
R43  72.12,7.75 180 top
R44  71.5,13.97 270 bottom
R45  14.61,35.43 0 top
U1  29.21,22.86 0 top
U2  68.45,12.7 0 top
U$1  11.43,22.86 0 top

### Tracks (layer width: path | path; a pad name or v marks a point on that pad's centre or on a via)
+5V  (via drill 0.33)
  Top 0.406: 76.85,12.31 L2.P$2
  Top 0.813: 77.79,14.23 v77.79,14.22 | R15.2 73.04,10.87 v74.11,11.94 | R14.2 76.05,11.54 L2.P$2
  other vias: 74.55,11.37 74.55,12.51 74.04,13.02 74.61,13.46 74.1,13.97 78.3,14.8 74.3,14.8 74.8,14.22 75.31,14.8 75.76,14.22 76.26,14.8 76.77,14.22 77.28,14.8
  pour Top (rank 2, no thermals): 73.72,14.92 79.95,14.92 79.95,11.05 73.72,11.05
  pour Bottom (no thermals): 73.91,21.72 80.39,21.72 80.39,10.79 78.87,10.79 73.66,5.59 26.42,5.59 25.91,5.08 25.91,1.14 25.4,0.64 24,0.64 23.5,1.14 23.5,7.24 25.02,8.76 71.88,8.76 73.91,10.79
  pour Route2 (no thermals): 86.36,15.75 86.36,12.7 arc-90 73.66,0 6.35,0 arc-90 0,6.35 0,15.75
AFEFUSE
  Top 0.406: J1.P$8 76.01,30.35 75.37,29.72 68.9,29.72 68.26,29.08 68.26,27.43 67.5,26.67 R5.1
  Bottom 0.61: 76.07,31.87 J1.P$8
DISP  (via drill 0.33)
  Top 0.305: U1.15 30.42,18.09 v30.86,17.65
  Route15 0.305: J4.7 16.29,27.65 17.27,26.67
  Route15 0.406: 17.27,26.67 17.27,19.56 19.81,17.02 30.23,17.02 v30.86,17.65
GND  (via drill 0.33, 0.51, 0.61, 0.81)
  Top 0.305: Q5.2 | v28.45,21.65 28.38,21.59 27.94,21.59 | v29.27,22.54 29.25,22.57 U1.HEATSINK
  Top 0.406: U1.9 27.42,21.07 27.94,21.59 | Q2.2 18.48,17.08 v18.54,17.02 20.19,17.02 20.69,16.52 C10.2 | Q4.2 18.48,12.13 v18.54,12.06 18.54,10.67 19.05,10.16 C12.2 | C13.2 18.67,7.62 17.78,8.51 15.11,8.51 14.86,8.76 v14.86,9.54 14.03,9.54 Q5.2 | C11.2 20.69,13.22 20.32,13.59 15.88,13.59 v14.86,14.61 | v37.85,19.94 37.84,19.93 C24.2 35.83,19.93 v35.81,19.94 | C23.2 37.73,24.65 v37.85,24.77 | v35.81,24.77 36.83,24.77 | C7.2 v44.45,39.12
  Top 0.61: C8.2 25.02,28.83 v25.4,29.21 | R34.1 v39.12,13.84 | Q3.2 14.8,14.67 v14.86,14.61
  Bottom 0.406: C17.2 36.2,25.15 v35.81,24.77 35.81,23.5 35.19,22.87 C20.2
  Bottom 0.61: C4.2 v60.83,47.88
  other vias: 28.45,22.54 28.45,23.37 28.45,24.19 71.12,36.83 69.85,36.83 68.58,36.83 67.31,36.83 71.12,38.1 69.85,38.1 68.58,38.1 67.31,38.1 66.04,38.1 71.12,39.37 69.85,39.37 68.58,39.37 67.31,39.37 66.04,39.37 71.12,40.64 69.85,40.64 68.58,40.64 67.31,40.64 66.04,40.64 29.27,21.65 29.27,23.37 29.27,24.19 30.16,21.65 30.16,22.54 30.16,23.37 30.16,24.19
  pour Route15 (no thermals): 0,48.26 arc-90 6.35,54.61 73.66,54.61 arc-90 86.36,41.91 86.36,12.7 arc-90 73.66,0 6.35,0 arc-90 0,6.35
  pour Top (no thermals): 74.55,35.75 74.55,41.85 73.03,43.37 73.03,44.45 72.45,45.02 65.21,45.02 65.21,37.15 66.61,35.75
GNDA  (via drill 0.33, 0.41, 0.51, 0.61)
  Top 0.305: U1.24 32.44,24.57 v33.15,25.27 | D5.A v43.05,9.78 | D3.A 46.36,9.65 v47.12,9.65 | D4.A 52.07,9.02 52.2,9.14 v52.2,9.65 | C33.2 v64.01,11.18 | Q6.1 48.26,42.98 v48.26,41.4
  Top 0.61: C29.2 C28.2
  Top 1.27: U2.11 68.45,15.27
  other vias: 37.21,30.48 37.21,29.72 36.45,30.48 40.77,11.56 41.4,11.56 42.04,11.56 42.67,11.56 43.31,11.56 43.94,11.56 44.58,11.56 45.21,11.56 45.85,11.56 46.48,11.56 47.12,11.56 46.61,33.15 47.37,33.15 46.61,32.38 47.37,32.38 69.79,46.35 70.99,46.35 72.14,46.35 72.14,47.5 70.99,47.5 69.79,47.5 73.41,47.5 74.68,47.5 75.95,47.5 77.22,47.5 77.22,46.23 75.95,46.23 74.68,46.23 73.41,46.23 74.68,44.96 75.95,44.96 75.95,43.69 77.22,44.96 77.22,43.69 47.75,11.56 48.39,11.56 49.02,11.56 49.66,11.56 50.29,11.56 50.93,11.56 51.56,11.56 52.2,11.56 52.83,11.56 53.47,11.56 67.94,15.24 68.83,15.24 68.07,16 69.09,16 68.71,16.64 69.34,17.27 68.9,11.94 68.07,11.94 68.9,12.7 68.9,13.46 68.07,13.46 68.07,12.7 77.98,8.61 11.43,1.27 8.89,1.27 6.35,1.27 3.81,2.54 1.27,6.35 2.54,3.81 1.27,17.78 1.27,19.05 1.27,34.29 1.27,36.83 2.54,50.8 3.81,52.07 6.35,53.34 8.89,53.34 11.43,53.34 1.27,39.37 1.27,41.59 1.27,45.28 1.27,46.99 83.82,46.99 80.01,51.31 84.84,44.51 84.84,41.91 85.03,39.37 84.84,34.29 84.96,31.75 84.84,29.15 84.84,26.67 84.84,24.13 84.84,21.59 84.84,19.05 84.84,16.51 84.84,13.97 84.84,11.43 83.57,8.89 80.01,3.3 77.72,1.78 77.72,52.83 84.84,36.83 1.27,43.37 68.58,47.5 68.58,46.35 74.68,43.69 77.98,7.34 36.45,29.72 36.45,28.96 37.21,28.96
  pour Top (no thermals): 38.35,30.86 36.07,30.86 36.07,28.7 38.35,28.7
  pour Bottom (rank 6, no thermals): 0,6.35 arc90 6.35,0 73.66,0 arc90 86.36,12.7 86.36,39.37 arc90 74.93,54.61 6.35,54.61 arc90 0,48.26
  pour Top (no thermals): 40.39,13.59 53.85,13.59 53.85,11.18 40.39,11.18
  pour Top (no thermals): 8.26,46.99 11.18,46.99 11.18,31.75 8.26,31.75
  pour Top (no thermals): 41.78,33.53 47.75,33.53 47.75,32 41.78,32
  pour Top (no thermals): 65.15,45.59 65.15,48.26 77.85,48.26 77.85,42.8 74.42,42.8 73.53,43.69 73.53,44.96 72.9,45.59
  pour Top (no thermals): 67.69,13.72 67.69,16 69.22,17.53 70.48,17.53 70.48,16 69.6,16 69.22,15.62 69.22,13.72
  pour Top (rank 6, no thermals): 0,6.35 arc90 6.35,0 73.66,0 arc90 86.36,12.7 86.36,41.91 arc90 73.66,54.61 6.35,54.61 arc90 0,48.26
LED1
  Top 0.279: 2.54,18.8 2.54,22.67
  Top 0.305: Q5.3 5.46,8.51 5.08,8.89 5.08,16.26 2.54,18.8 | J4.4 1.56,23.65 2.54,22.67
LED2
  Top 0.279: 4.16,24.67 2.54,24.67
  Top 0.305: Q4.3 6.22,11.18 5.59,11.81 5.59,23.24 4.16,24.67 | J4.6 1.56,25.65 2.54,24.67
LED3
  Top 0.279: 4.06,26.67 2.54,26.67
  Top 0.305: Q3.3 6.86,13.72 6.1,14.48 6.1,24.64 4.06,26.67 | J4.8 1.56,27.65 2.54,26.67
LED4
  Top 0.279: 4.22,28.67 2.54,28.67
  Top 0.305: Q2.3 7.37,16.13 6.6,16.89 6.6,26.29 4.22,28.67 | J4.10 1.56,29.65 2.54,28.67
N$1  (via drill 0.33, 0.6)
  Top 0.305: U1.21 34.5,23.07 35.05,23.62
  Top 0.406: 35.05,23.62 35.05,25.27 35.43,25.65 v38.86,25.65 | v62.6,26.67 R5.2
  Route15 0.406: v38.86,25.65 39.88,26.67 v62.6,26.67
N$2  (via drill 0.6)
  Route15 0.406: v55.75,43.43 70.67,43.43 73.09,41.02 75.37,41.02 76.01,40.39 J1.P$5
  Bottom 0.406: R2.1 v55.75,43.43
N$3  (via drill 0.51)
  Route15 0.406: v56.77,44.32 71.25,44.32 73.66,41.91 76.2,41.91 77.47,40.64 77.47,37.4 76.88,36.81 J1.P$6
  Bottom 0.61: R3.1 55.94,45.15 v56.77,44.32
N$4  (via drill 0.51)
  Route15 0.406: v58.04,46.1 66.42,46.1 67.44,45.09 71.88,45.09 74.17,42.8 76.39,42.8 78.23,40.96 78.23,35.37 77.17,34.31 J1.P$7
  Bottom 0.406: R4.1 56.9,46.99 57.78,46.1 v58.04,46.1
N$5
  pour Top (no thermals): 74.55,35.24 74.55,30.73 66.48,30.73 66.48,35.24
N$6  (via drill 0.33)
  Top 0.305: U1.6 22.3,22.15 v21.84,22.61
  Bottom 0.305: R4.2 52.44,47.61 52.7,47.88 56,47.88 C3.2
  Bottom 0.406: v21.84,22.61 21.84,36.58 24.38,39.12 31.75,39.12 32.26,39.12 32.36,39.12 40.23,46.99 R4.2 | C3.2 C4.1
N$7  (via drill 0.33)
  Top 0.305: U1.3 24.61,23.65 v24.13,24.13
  Bottom 0.406: v24.13,24.13 24.13,35.56 25.4,36.83 33.02,36.83 39.75,43.56 47.5,43.56 49.15,41.91 49.16,41.92 R1.2 50.42,41.27 50.8,40.89 52.07,40.89 52.45,40.51 C1.1
N$8  (via drill 0.33)
  Top 0.305: U1.4 23.84,23.15 v23.37,23.62
  Bottom 0.406: v23.37,23.62 23.37,35.81 25.15,37.59 32.77,37.59 39.62,44.45 48.26,44.45 49.28,43.43 R2.2 52.44,41.93 C1.2 52.45,41.53 53.09,40.89 53.98,40.89 54.36,40.51 C2.1
N$9  (via drill 0.33)
  Top 0.305: U1.5 23.07,22.65 v22.61,23.11
  Bottom 0.305: C3.1 52.82,46.09 52.44,45.71 R3.2 53.15,45.15 53.4,44.9 53.4,42.67 53.91,42.16 54.11,42.16 C2.2
  Bottom 0.406: v22.61,23.11 22.61,36.2 24.77,38.35 32.51,38.35 39.31,45.15 R3.2
N$10  (via drill 0.51, 0.6)
  Top 0.305: U1.8 25.47,21.15 23.75,19.43 21.6,19.43
  Top 0.406: 21.6,19.43 C5.1 C6.1 v19.81,18.29 | R32.P$4 62.99,44.32 v62.23,45.09
  Route15 0.406: v62.23,45.09 24.13,45.09 22.35,43.31 22.35,24.26 21.08,22.99 21.08,20.57 19.81,19.3 v19.81,18.29
N$11  (via drill 0.51)
  Top 0.305: U1.7 25.21,21.65 24.77,21.21 21.6,21.21
  Top 0.406: 21.6,21.21 C5.2 C6.2 v19.81,22.73 | R32.P$3 63.12,46.1 v62.23,46.99
  Route15 0.406: v62.23,46.99 24.13,46.99 21.59,44.45 21.59,24.51 v19.81,22.73
N$13
  Top 0.813: R6.2 50.04,39.12 48.78,40.37 D1.1 D1.2
N$14  (via drill 0.51)
  Top 0.406: U1.1 26.65,29.44 v27.94,30.73 | v39.12,38.23 C7.1
  Top 0.61: D1.3 46.94,38.22 C7.1
  Route15 0.406: v27.94,30.73 27.94,36.58 29.59,38.23 v39.12,38.23
N$15
  Top 0.305: U1.2 25.38,24.15 25.02,24.51 C8.1
N$16
  Bottom 0.61: R21.2 R22.2 29.02,10.54 28.13,11.43 24.07,11.43 22.23,9.59 PCB1.P9.4 PCB1.P9.3
N$18  (via drill 0.41)
  Top 0.305: U1.22 33.55,23.57 v34.16,24.18
  Bottom 0.406: v34.16,24.18 R23.1
  Bottom 0.813: R23.1 34.19,27.44 C17.1
N$20  (via drill 0.33)
  Top 0.305: U1.10 27.92,15.86 27.3,15.24 R8.2 v25.4,15.24
  Route2 0.305: J3.1 1.54,16.78 2.03,17.27 17.02,17.27 19.05,15.24 v25.4,15.24
N$21  (via drill 0.33)
  Top 0.305: U1.11 28.42,13.18 27.94,12.7 R9.2 v25.4,12.7
  Route2 0.305: v25.4,12.7 2.54,12.7 J3.3
N$22  (via drill 0.33)
  Top 0.305: U1.12 28.92,10.76 28.32,10.16 R10.2 v25.4,10.16
  Route2 0.305: J3.5 2.57,10.67 24.89,10.67 v25.4,10.16
N$23  (via drill 0.33)
  Top 0.305: U1.13 29.42,8.21 28.83,7.62 R11.2 26.29,8.51 25.91,8.89 v23.5,8.89
  Route2 0.305: v23.5,8.89 5.08,8.89 4.45,8.26 2.03,8.26 1.52,8.76 1.52,9.68 J3.7
N$24
  Top 0.406: R8.1 C10.1 22.48,15.23 22.48,14.61 22.1,14.22 19.43,14.22 18.48,15.18 Q2.1
N$26
  Top 0.406: R9.1 C11.1 22.49,11.82 22.23,11.56 19.94,11.56 19.56,11.94 19.56,12.57 19.18,12.95 15.75,12.95 15.56,12.77 Q3.1
N$28
  Top 0.406: R10.1 C12.1 22.48,10.15 22.48,9.65 21.97,9.14 18.29,9.14 17.64,9.79 Q4.1
N$30
  Top 0.406: R11.1 C13.1 22.48,7.61 22.48,6.86 21.97,6.35 19.05,6.35 17.84,7.56 Q5.1
N$32
  Top 0.305: C32.2 67.8,10.17 R12.2
N$33
  Top 0.305: C30.1 66.36,13.2 U2.2
N$34
  Top 0.305: U2.4 66.17,12.2 65.79,11.81 65.79,8.76 66.17,8.38 66.79,8.38 C32.1 67.94,8.37 C31.1
N$35
  Top 0.305: U2.5 66.95,11.28 67.31,10.92 69.6,10.92 69.86,10.66 R12.1
  Top 0.406: C35.2 74.5,9.02 74.27,8.79 71.26,8.79 71.24,8.76
  Top 0.61: C31.2 R12.1
  Top 0.813: R12.1 71.17,9.91 R15.1 71.24,8.76 71.24,7.76 R43.2
N$36
  Top 0.61: C14.1 R17.1
N$37  (via drill 0.33)
  Top 0.305: U1.31 28,28.76 v28.7,29.46 | v40.77,39.62 42.05,39.62 R16.1
  Route15 0.406: v28.7,29.46 29.46,29.46 29.84,29.84 29.84,35.69 31.11,36.96 40.01,36.96 40.77,37.72 v40.77,39.62
N$38
  Top 0.305: U2.8 70.74,12.7 71.36,13.32 71.36,14.28 | 71.36,14.28 71.36,15.44 | C34.2 71.45,14.36 71.36,14.28
  pour Top (no thermals): 72.52,20.57 74.42,20.57 74.74,20.26 74.74,19.43 74.99,19.18 78.61,19.18 78.61,16.26 74.99,16.26 74.1,15.37 71.12,15.37 71.12,17.53 72.52,17.53
N$39  (via drill 0.41)
  Top 0.406: v32.89,33.15 36.35,33.15 Q8.P$6
  Bottom 0.406: v32.89,33.15 32.37,32.63 R23.2
  pour Top (no thermals): 36.2,37.59 38.35,37.59 38.86,37.08 46.23,37.08 46.23,34.67 38.48,34.67 38.48,31.75 36.2,31.75
N$40  (via drill 0.33)
  Top 0.406: R19.2 31.89,34.68 32.26,35.05 32.55,35.35 32.62,35.41 Q7.P$4 35.18,34.84 v35.18,34.16 | R20.1 43.42,42.67 v42.42,42.67
  Top 0.61: Q6.2 44.35,43.6 R20.1
  Route15 0.406: v42.42,42.67 42.42,37.21 41.02,35.81 35.56,35.81 35.18,35.43 v35.18,34.16
N$41
  Top 0.254: U1.29 29,26.5 28.89,26.61 28.89,27.5 29.34,27.94
  Top 0.305: 29.34,27.94 29.34,32.52 R19.1
N$42  (via drill 0.3, 0.33)
  Top 0.254: Q14.P$4 72.92,21.02 74.23,21.02 v74.49,21.27
  Top 0.305: U2.7 v71.44,12.2 v71.45,12.21
  Route15 0.305: v71.45,12.21 72.2,12.21 72.9,12.9 72.9,18.73 74.49,20.32 v74.49,21.27
N$43  (via drill 0.33, 0.41)
  Top 0.254: v40.26,34.54 39.5,34.54 39.24,34.29 Q8.P$4 | v34.54,32.13 30.99,32.13 29.97,31.11 29.97,27.71 30.02,27.66 30.02,26.77 30,26.75 U1.27
  Route15 0.406: v34.54,32.13 39.24,32.13 40.26,33.15 v40.26,34.54
N$45
  Top 0.254: U1.25 31,27.7 31.54,28.23 Q9.P$4
N$47  (via drill 0.33)
  Top 0.305: U2.9 70.6,13.2 70.74,13.34 v70.74,14.1 70.74,14.61 70.1,15.24 Q15.P$4
  Bottom 0.305: R44.1 v70.74,14.1
N$48  (via drill 0.33)
  Top 0.254: U1.30 28.5,26.36 28.45,26.42 28.45,28.12 v28.65,28.32
  Bottom 0.254: R28.1
  Bottom 0.305: R28.1 54.61,17.78 53.34,16.51 29.21,16.51 27.3,18.41 27.3,27.5 28.13,28.32 v28.65,28.32
N$49  (via drill 0.33)
  Top 0.305: U1.32 27.5,29.28 v27.81,29.59
  Bottom 0.305: R27.1 54.62,30.97 55.37,30.21 55.37,17.65 53.59,15.88 28.96,15.88 26.86,17.97 26.86,27.94 27.81,28.89 v27.81,29.59
N$50  (via drill 0.33)
  Top 0.254: v57.53,21.34 57.53,21.84 57.15,22.23 56.64,22.23 56.39,22.48 R30.1 56.12,22.73 Q13.P$4
  Bottom 0.254: R28.2 57.28,21.08 v57.53,21.34
N$51  (via drill 0.33)
  Top 0.305: v51.56,30.61 51.56,29.59 51.82,29.34 Q12.P$4 52.37,28.79 52.45,28.7 54.99,28.7 55.37,28.32 55.37,26.67 55.64,26.41 R29.1
  Bottom 0.305: R27.2 51.94,30.99 v51.56,30.61
N$52
  pour Top (no thermals): 55.5,23.75 55.5,28.19 50.93,28.19 50.93,23.75
N$53
  Top 0.305: U2.3 62.41,12.7 R13.1
N$54  (via drill 0.3)
  Top 0.305: U1.28 29.5,27.02 v29.46,27.05
  Bottom 0.254: 31.19,20.64 arc90 C21.1
  Bottom 0.305: 31.19,20.64 28.38,20.64 27.75,21.27 27.75,26.48 28.32,27.05 v29.46,27.05
  Bottom 0.61: D2.3 31.29,20.65 C21.1
N$55
  Top 0.61: C19.1 C18.2
N$56  (via drill 0.33)
  Top 0.254: U1.26 30.5,29.21 | 30.5,29.21 30.5,30.37 31.37,31.24 40.25,31.24 | v31.11,29.46 30.75,29.46 30.5,29.21
  Bottom 0.254: C21.2 31.24,29.34 v31.11,29.46
  pour Top (no thermals): 38.99,33.91 40.64,33.91 41.15,33.53 41.15,31.5 41.53,31.11 48.77,31.11 49.15,30.73 49.15,27.94 48.77,27.56 39.37,27.56 38.99,27.94
N$57  (via drill 0.33)
  Top 0.305: 33.02,24.13 v33.15,24.26 32.96,24.07 U1.23
  Bottom 0.305: C20.1 33.78,21.59 33.53,21.84 33.02,21.84 32.77,22.1 32.77,23.88 v33.15,24.26
  Bottom 0.813: D2.2 D2.1 33.38,20.67 C20.1
N$58
  pour Top (no thermals): 48.9,25.4 40.39,25.4 40.39,22.48 48.9,22.48
N$59
  Top 0.305: U1.20 36.55,22.57 C23.1 37.95,22.85 C22.1 38.33,23.23 R31.P$3
N$60
  Top 0.305: U1.19 36.49,22.07 C24.1 37.82,21.73 C22.2 38.33,21.23 R31.P$4
N$62
  Top 0.305: U1.18 34.31,21.57 35.05,20.83
  Top 0.406: R33.1 35.57,15.61 35.05,16.13 35.05,20.83
  Top 0.61: C27.2 R33.1 36.2,13.85 R34.2
N$64
  Top 0.305: U1.16 30.92,18.74 31.62,18.03
  Top 0.406: 31.62,18.03 31.62,9.14 32.51,8.26 R35.1
N$65
  Top 0.406: R35.2 R36.1 43.94,8.51 D3.C
N$66  (via drill 0.33)
  Top 0.305: R36.2 46.35,8.26 46.74,7.87 46.74,6.6 47.12,6.22 49.66,6.22 50.16,5.71 PCB1.P9.26
  Route15 0.61: v33.97,12.13 34.86,12.13 35.56,11.43 35.56,8.26 36.26,7.56 49.09,7.56 50.16,6.48 PCB1.P9.26
  Bottom 0.61: R21.1 v33.97,12.13
N$67
  Top 0.305: U1.17 32.4,21.07 33.02,20.45
  Top 0.406: 33.02,20.45 33.02,11.81 34.16,10.67 47.12,10.67 47.88,9.91 R37.1
N$68
  Top 0.305: D4.C 49.67,8.49 R37.2
  Top 0.406: R38.1 R37.2
N$69  (via drill 0.33)
  Top 0.305: PCB1.P9.24 48.9,3.17 50.8,3.17 51.44,3.81 51.44,5.71 52.72,7 R38.2
  Route15 0.61: PCB1.P9.24 47.62,5.71 46.99,6.35 34.99,6.35 34.16,7.18 v34.16,9.72
  Bottom 0.61: v34.16,9.72 34.16,10.1 33.72,10.54 R22.1
N$70  (via drill 0.33)
  Top 0.305: U2.10 69.95,14.43 v69.72,14.66 v69.72,14.67
  Top 0.61: C33.1 64.77,10.21 v65.16,10.6
  Top 0.813: R13.2 62.74,10.21 C33.1
  Route15 0.305: v69.72,14.67 69.58,14.53 65.53,14.53 65.16,14.16 v65.16,10.6
N$71
  Top 0.305: U1.14 29.92,7.67
  Top 0.406: R39.1 30.73,6.86 29.92,7.67
N$72
  Top 0.406: R40.1 R39.2 41.53,6.86 41.27,7.11 41.27,9.4 40.89,9.78 D5.C
N$73
  Top 0.305: 45.47,6.85 45.47,6.1 46.35,5.21 46.35,1.02 46.74,0.64 71.75,0.64 PCB1.P9.43
  Top 0.406: 45.47,6.85 R40.2
N$74
  Top 0.305: U2.6 71.05,11.7 71.14,11.61 72.19,11.61 72.52,11.94 C34.1
N$76
  Top 0.813: R14.1 C35.1
N$77
  Top 0.61: C44.1 R45.1
PWR
  Route15 0.305: J4.3 4.16,23.65 5.08,22.73 5.08,8.89 6.35,7.62 26.92,7.62 28.57,5.97 28.57,3.17 PCB1.P9.9
VAC
  Top 0.61: Q6.3 46.97,41.77 R20.2 44.22,41.67 R16.2 39.76,41.67 38.99,40.89 38.99,39.62 38.23,38.86 35.18,38.86 | R45.2 15.51,33.92 14.61,33.02 R18.2 12.2,30.68 11.19,29.67 3.54,29.67 J4.9
  pour Top (no thermals): 12.19,45.85 28.96,45.72 29.97,44.7 29.97,40.26 30.99,39.24 35.56,39.24 35.56,35.94 32.26,35.94 31.11,34.8 14.61,34.8 14.61,38.73 12.19,41.15
VBAT
  Route2 0.305: J4.5 21.84,25.65 22.86,26.67 22.86,34.29 24.13,35.56 C45.1
  Bottom 0.813: R1.1 50.42,37.21 52.07,35.56 C45.1
  pour Top (no thermals): 49.15,34.92 52.07,34.92 53.59,36.45 64.64,36.45 65.15,35.94 65.15,32.38 49.15,32.38
  pour Top (rank 2, no thermals): 52.96,29.08 52.96,31.24 51.69,32.51 61.72,32.51 59.18,29.97 59.18,26.16 58.93,25.91 58.17,25.91 57.91,26.16 57.91,27.05 57.53,27.43 56.13,27.43 55.88,27.69 55.88,28.57 55.37,29.08
VSYS  (via drill 0.33)
  Top 0.305: 54.61,21.59 55,21.2 R30.2 56.39,20.45 56.64,20.19 58.05,20.19 C19.2 | U2.1 66.95,19.41
  Top 0.61: R33.2 C27.1
  Top 0.813: C27.1 38.73,18.41 39.37,19.05 v41.91,19.05
  other vias: 41.02,17.27 41.91,17.27 42.8,17.27 43.69,17.27 44.58,17.27 45.47,17.27 46.35,17.27 47.24,17.27 48.13,17.27 49.02,17.27 49.91,17.27 50.8,17.27 51.69,17.27 52.58,17.27 53.47,18.16 52.58,18.16 51.69,18.16 50.8,18.16 49.91,18.16 49.02,18.16 48.13,18.16 47.24,18.16 46.35,18.16 45.47,18.16 44.58,18.16 43.69,18.16 42.8,18.16 41.91,18.16 41.02,18.16 53.47,19.05 52.58,19.05 51.69,19.05 50.8,19.05 49.91,19.05 49.02,19.05 48.13,19.05 47.24,19.05 46.35,19.05 45.47,19.05 44.58,19.05 43.69,19.05 42.8,19.05 41.02,19.05 57.47,19.05 58.55,19.05 59.88,19.56 56.32,19.05 74.1,22.73 74.1,23.75 69.98,27.81 69.98,26.86 60.58,24.45 61.47,24.45 62.36,24.45 63.25,24.45 64.14,24.45 65.02,24.45 65.91,24.45 66.8,24.45 67.69,24.45 69.22,25.08 60.58,23.18 60.58,21.91 60.58,20.64
  pour Top (no thermals): 40.39,21.72 49.53,21.59 49.78,21.84 49.78,23.11 53.85,23.11 53.85,22.03 54.17,21.72 55.05,21.72 55.37,21.4 55.37,15.11 40.39,15.11
  pour Top (no thermals): 56.52,19.56 59.18,19.56 59.94,20.32 72.01,20.32 72.01,17.91 68.96,17.91 66.67,15.62 56.01,15.62 55.37,15.11 55.37,20.38 55.69,20.38
  pour Route2 (isolate 0.254, no thermals): 6.35,54.61 73.66,54.61 arc-90 86.36,41.91 86.36,16.51 0,16.51 0,48.26 arc-90
  pour Top (no thermals): 70.03,28.88 74.55,28.88 74.55,22.48 73.6,21.53 72.33,21.53 71.95,21.15 71.95,20.32 59.94,20.32 59.94,24.51 60.58,25.15 68.33,25.15 69.22,26.04 69.22,28.07

### Text on the board
tPlace: GRISSOM | BMU02-1644_GS | PACK | CHARGER | AUX | EXT. CONTROL | NTC